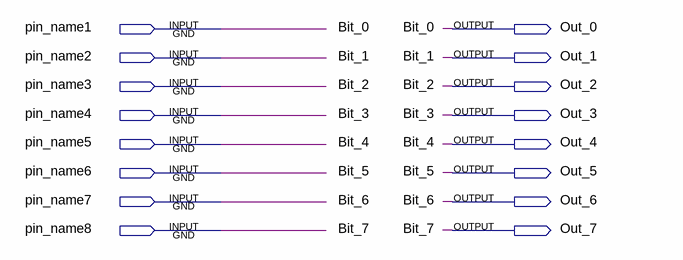
[diagram p0: schematic sheet]
// Quartus schematic CPLD_Test.bdf as structural Verilog: 0 symbols, 16 pins
module CPLD_Test (
  input  pin_name1,
  input  pin_name2,
  input  pin_name3,
  input  pin_name4,
  input  pin_name5,
  input  pin_name6,
  input  pin_name7,
  input  pin_name8,
  output Out_0,
  output Out_1,
  output Out_2,
  output Out_3,
  output Out_4,
  output Out_5,
  output Out_6,
  output Out_7
);


  assign Out_0 = pin_name1;
  assign Out_1 = pin_name2;
  assign Out_2 = pin_name3;
  assign Out_3 = pin_name4;
  assign Out_4 = pin_name5;
  assign Out_5 = pin_name6;
  assign Out_6 = pin_name7;
  assign Out_7 = pin_name8;

  // Other names for the same wires on the sheet: Bit_0 = pin_name1; Bit_1 = pin_name2; Bit_2 = pin_name3;
  //   Bit_3 = pin_name4; Bit_4 = pin_name5; Bit_5 = pin_name6; Bit_6 = pin_name7; Bit_7 = pin_name8
endmodule
